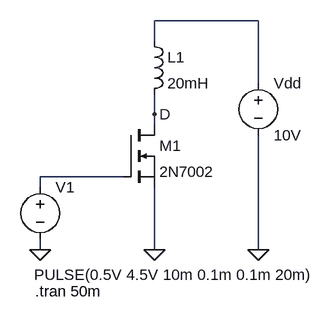
[diagram p0: schematic FET-switch-ind-1.asc]
FET-switch-ind-1.asc, the LTspice schematic file:
Version 4
SHEET 1 880 680
WIRE 416 48 256 48
WIRE 256 80 256 48
WIRE 416 144 416 48
WIRE 256 192 256 160
WIRE 256 208 256 192
WIRE 208 288 80 288
WIRE 80 304 80 288
WIRE 80 400 80 384
WIRE 256 400 256 304
WIRE 416 400 416 224
FLAG 416 400 0
FLAG 256 192 D
FLAG 256 400 0
FLAG 80 400 0
SYMBOL voltage 416 128 R0
WINDOW 123 0 0 Left 0
WINDOW 39 0 0 Left 0
SYMATTR InstName Vdd
SYMATTR Value 10V
SYMBOL nmos 208 208 R0
SYMATTR InstName M1
SYMATTR Value 2N7002
SYMBOL ind 240 64 R0
SYMATTR InstName L1
SYMATTR Value 20mH
SYMATTR SpiceLine Rser=68
SYMBOL voltage 80 288 R0
WINDOW 3 -9 151 Left 2
WINDOW 123 0 0 Left 0
WINDOW 39 -9 169 Left 2
SYMATTR Value PULSE(0.5V 4.5V 10m 0.1m 0.1m 20m)
SYMATTR InstName V1
TEXT 72 464 Left 2 !.tran 50m

The netlist it stands for:
* FET-switch-ind-1.asc
Vdd N001 0 10V
M1 D N002 0 0 2N7002
L1 N001 D 20mH Rser=68
V1 N002 0 PULSE(0.5V 4.5V 10m 0.1m 0.1m 20m)
.model NMOS NMOS
.model PMOS PMOS
.lib standard.mos
.tran 50m
.backanno
.end